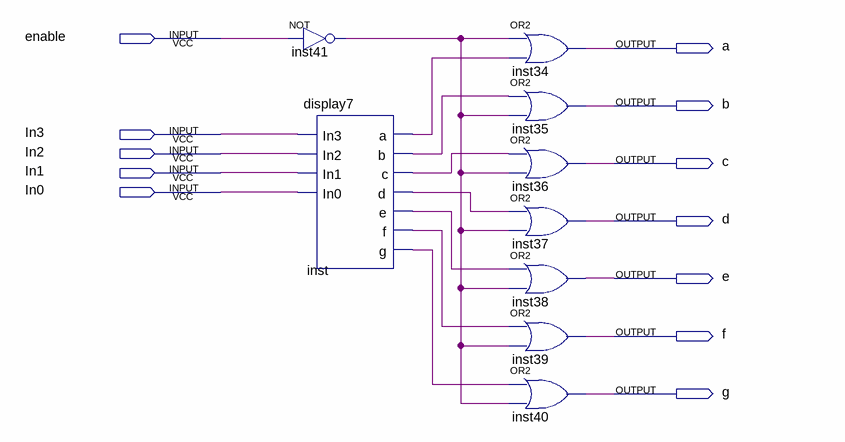
[diagram p0: schematic sheet]
// Quartus schematic display7_en.bdf as structural Verilog: 9 symbols, 12 pins
module display7_en (
  input  enable,
  input  In3,
  input  In2,
  input  In1,
  input  In0,
  output a,
  output b,
  output c,
  output d,
  output e,
  output f,
  output g
);

  wire inst41_out, inst_a, inst_b, inst_c, inst_d, inst_e, inst_f, inst_g;

  not inst41 (inst41_out, enable);
  display7 inst (
    .In3(In3), .In2(In2), .In1(In1), .In0(In0), .a(inst_a), .b(inst_b), .c(inst_c), .d(inst_d), .e(inst_e),
    .f(inst_f), .g(inst_g));
  or inst34 (a, inst41_out, inst_a);
  or inst35 (b, inst_b, inst41_out);
  or inst36 (c, inst_c, inst41_out);
  or inst37 (d, inst_d, inst41_out);
  or inst38 (e, inst_e, inst41_out);
  or inst39 (f, inst_f, inst41_out);
  or inst40 (g, inst_g, inst41_out);
endmodule
